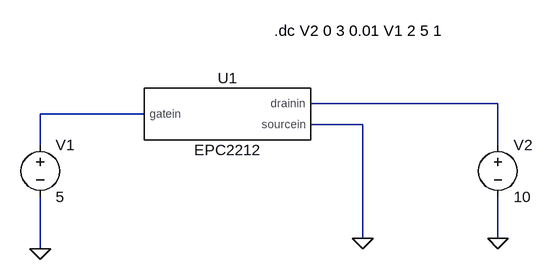
[diagram p0: schematic EPC_IV_curves.asc]
EPC_IV_curves.asc, the LTspice schematic file:
Version 4
SHEET 1 880 680
WIRE 608 144 320 144
WIRE 64 160 -96 160
WIRE 400 176 320 176
WIRE -96 208 -96 160
WIRE 608 208 608 144
WIRE 400 352 400 176
WIRE 608 352 608 288
WIRE -96 368 -96 288
FLAG -96 368 0
FLAG 608 352 0
FLAG 400 352 0
SYMBOL AutoGenerated\\EPC2212 192 160 R0
SYMATTR InstName U1
SYMBOL voltage -96 192 R0
WINDOW 123 0 0 Left 0
WINDOW 39 0 0 Left 0
SYMATTR InstName V1
SYMATTR Value 5
SYMBOL voltage 608 192 R0
WINDOW 123 0 0 Left 0
WINDOW 39 0 0 Left 0
SYMATTR InstName V2
SYMATTR Value 10
TEXT 264 32 Left 2 !.dc V2 0 3 0.01 V1 2 5 1

The netlist it stands for:
* EPC_IV_curves.asc
XU1 N002 N001 0 EPC2212  ; pins gatein drainin sourcein
V1 N002 0 5
V2 N001 0 10
.dc V2 0 3 0.01 V1 2 5 1
.lib C:\Users\taf27\Desktop\Class-E-Optimization\EPCGaNLibrary\EPCGaNLibrary.lib
.backanno
.end